# Altium schematic sheet 452006257#BDU控制板3-功能安全.SchDoc
size A3; SheetNumber: 11; SheetTotal: 14
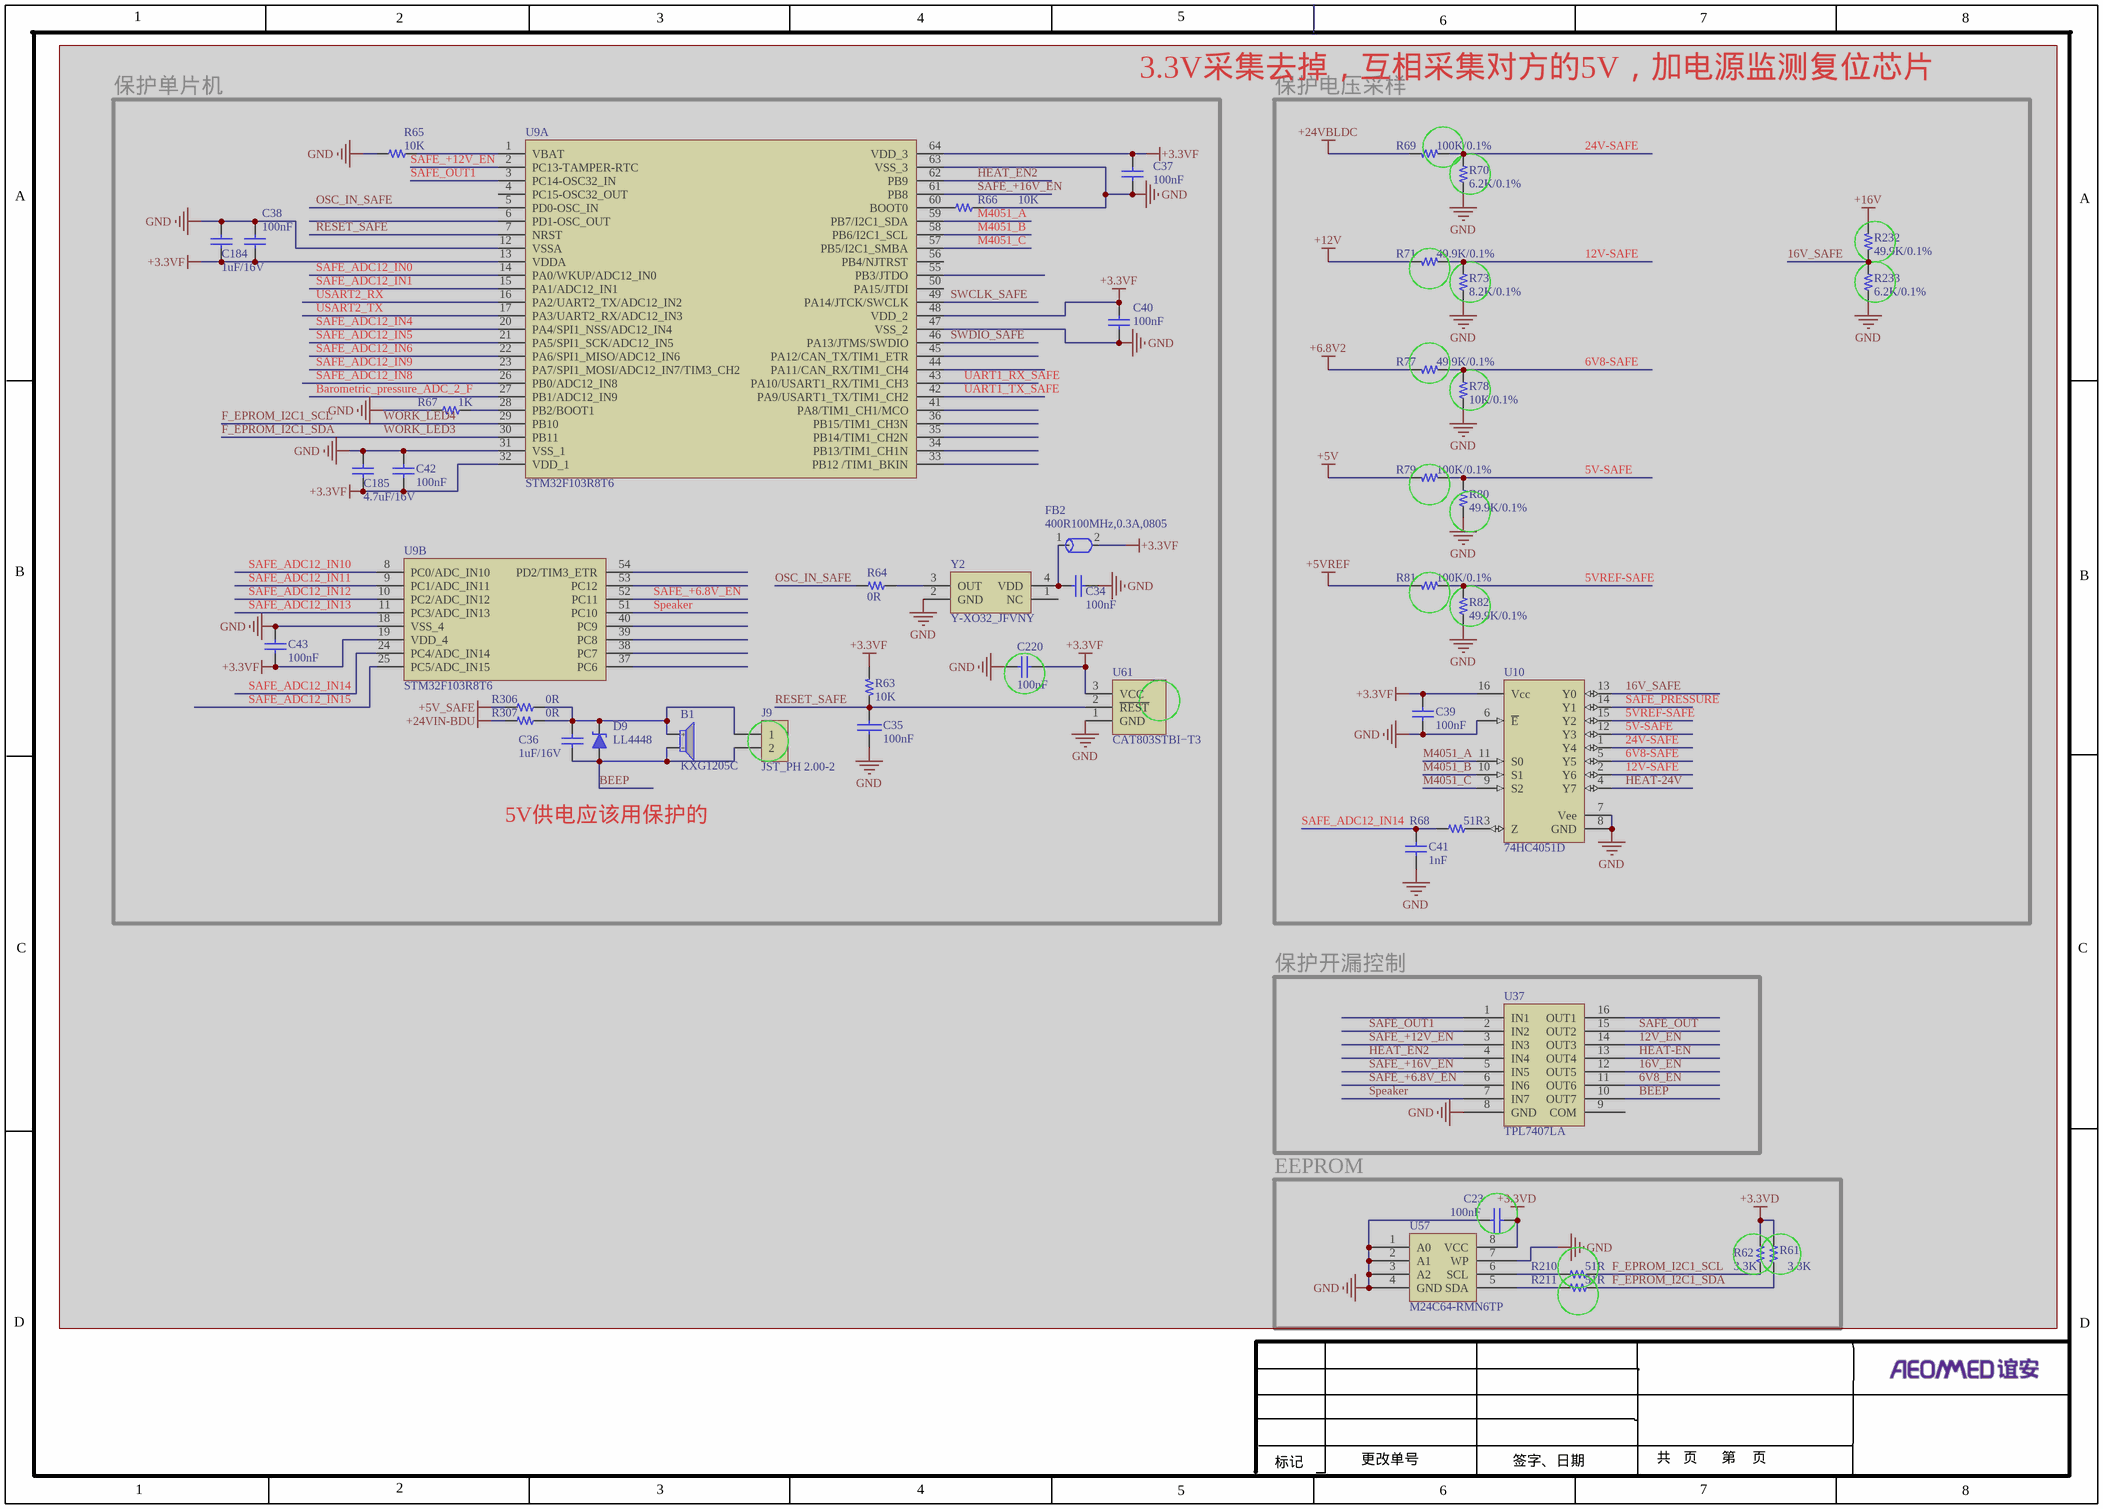
[diagram p0: 452006257#BDU控制板3-功能安全.SchDoc]

## Parts
B1  KXG1205C  [BEEP]  (masked out: inside a compile mask, not in the netlist)
C23  100nF  [C-0603]  (masked out: inside a compile mask, not in the netlist)
C34  100nF  [C-0603]  (masked out: inside a compile mask, not in the netlist)
C35  100nF  [C-0603]  (masked out: inside a compile mask, not in the netlist)
C36  1uF/16V  [C-0805]  (masked out: inside a compile mask, not in the netlist)
C37  100nF  [C-0603]  (masked out: inside a compile mask, not in the netlist)
C38  100nF  [C-0603]  (masked out: inside a compile mask, not in the netlist)
C39  100nF  [C-0603]  (masked out: inside a compile mask, not in the netlist)
C40  100nF  [C-0603]  (masked out: inside a compile mask, not in the netlist)
C41  1nF  [C-0603]  (masked out: inside a compile mask, not in the netlist)
C42  100nF  [C-0603]  (masked out: inside a compile mask, not in the netlist)
C43  100nF  [C-0603]  (masked out: inside a compile mask, not in the netlist)
C184  1uF/16V  [C-0805]  (masked out: inside a compile mask, not in the netlist)
C185  4.7uF/16V  [C-0805]  (masked out: inside a compile mask, not in the netlist)
C220  100nF  [C-0603]  (masked out: inside a compile mask, not in the netlist)
D9  LL4448  [DO-SOD-123]  (masked out: inside a compile mask, not in the netlist)
FB2  400R100MHz,0.3A,0805  [R-0805]  (masked out: inside a compile mask, not in the netlist)
J9  JST_PH 2.00-2  [JST_PH 2.00-2]  (masked out: inside a compile mask, not in the netlist)
R61  3.3K  [R-0603]  (masked out: inside a compile mask, not in the netlist)
R62  3.3K  [R-0603]  (masked out: inside a compile mask, not in the netlist)
R63  10K  [R-0603]  (masked out: inside a compile mask, not in the netlist)
R64  0R  [R-0603]  (masked out: inside a compile mask, not in the netlist)
R65  10K  [R-0603]  (masked out: inside a compile mask, not in the netlist)
R66  10K  [R-0603]  (masked out: inside a compile mask, not in the netlist)
R67  1K  [R-0603]  (masked out: inside a compile mask, not in the netlist)
R68  51R  [R-0603]  (masked out: inside a compile mask, not in the netlist)
R69  100K/0.1%  [R-0603]  (masked out: inside a compile mask, not in the netlist)
R70  6.2K/0.1%  [R-0603]  (masked out: inside a compile mask, not in the netlist)
R71  49.9K/0.1%  [R-0603]  (masked out: inside a compile mask, not in the netlist)
R73  8.2K/0.1%  [R-0603]  (masked out: inside a compile mask, not in the netlist)
R77  49.9K/0.1%  [R-0603]  (masked out: inside a compile mask, not in the netlist)
R78  10K/0.1%  [R-0603]  (masked out: inside a compile mask, not in the netlist)
R79  100K/0.1%  [R-0603]  (masked out: inside a compile mask, not in the netlist)
R80  49.9K/0.1%  [R-0603]  (masked out: inside a compile mask, not in the netlist)
R81  100K/0.1%  [R-0603]  (masked out: inside a compile mask, not in the netlist)
R82  49.9K/0.1%  [R-0603]  (masked out: inside a compile mask, not in the netlist)
R210  51R  [R-0603]  (masked out: inside a compile mask, not in the netlist)
R211  51R  [R-0603]  (masked out: inside a compile mask, not in the netlist)
R232  49.9K/0.1%  [R-0603]  (masked out: inside a compile mask, not in the netlist)
R233  6.2K/0.1%  [R-0603]  (masked out: inside a compile mask, not in the netlist)
R306  0R  [R-0603]  (masked out: inside a compile mask, not in the netlist)
R307  0R  [R-0603]  (masked out: inside a compile mask, not in the netlist)
U9  STM32F103R8T6  [LQFP-64]  (parts A,B of 2)  (masked out: inside a compile mask, not in the netlist)
U10  74HC4051D  [SOIC-16(9.95*3.90)]  (masked out: inside a compile mask, not in the netlist)
U37  TPL7407LA  [SOIC16]  (masked out: inside a compile mask, not in the netlist)
U57  M24C64-RMN6TP  [SOIC8]  (masked out: inside a compile mask, not in the netlist)
U61  CAT803STBI−T3  [SOT23-3]  (masked out: inside a compile mask, not in the netlist)
Y2  Y-XO32_JFVNY  [Y-XO32_JFVNY]  (masked out: inside a compile mask, not in the netlist)

## Blocks framed on the sheet
3.3V采集去掉，互相采集对方的5V，加电源监测复位芯片: B1 C34-C38 C40 C42 C43 C184 C185 C220 D9 FB2 J9 R63-R67 R306 R307 U9 U61 Y2
保护电压采样: C39 C41 R68-R71 R73 R77-R82 R232 R233 U10
保护开漏控制: U37
EEPROM: C23 R61 R62 R210 R211 U57

## Notes on the sheet
- 保护单片机
- 5V供电应该用保护的
- 1
- 2
- 3
- 4
- 5
- 6
- 7
- 8
- A
- B
- C
- D
- 更改单号
- 共   页      第    页
- 标记
- 签字、日期

## Library data of the parts
B1 = BEEP: 品牌：RS PRO,型号：KXG1205C，5V，94dBA; 厂家: *; 物料名称: *; 物料编号: *; 详细描述: *
C23 C35 = CAP: Capacitor
C34 C36 C39 C41 = C-0603: 物料编号: *; 物料名称: *; 厂家: *; 详细描述: *
C37 C38 C40 C42 C43 = 100nF_1: 贴片瓷介电容100nF±5%,0805; 物料编号: 210001894; 详细描述: X7R,50V,三星CL21B104JBCNNNC; 版本: V1.00; 制造商: 三星; 名称: 贴片瓷介电容100nF±5%,0805
C184 C185 = CAP: Capacitor; Fitted: True
C220 = C-0402: 物料编号: *; 物料名称: *; 厂家: *; 详细描述: *
D9 = Diode-稳压-213AB/LL34/MiniMELF: 厂家: *; 物料名称: *; 物料编号: *; 详细描述: *
FB2 = FB_1K/500mA_0805: Rdc0.3Ω,伍尔特,742792032; 名称: 贴片磁珠1K/500mA，0805; 版本: V1.00; 物料编号: 210001925; 详细描述: Rdc0.3,R材料,TDK MMZ2012R102A; 制造商: TDK
J9 = JST_PH 2.00-2: 品牌：JST 型号：B2B-PH-K-S，直插，间距2.00，2pin
R61 R62 R64 R68 R306 R307 = R-0603
R63 R69 R71 R77 R79 R81 R232 = 100Ω_1: 国巨RC0805FR-07100R; 物料编号: 210000765; 详细描述: 0805,1/8W,国巨RC0805FR-07100R; 制造商: 国巨; 版本: V1.00; 名称: 贴片电阻100±1%
R65 = R-0603: 10K±1%
R66 R67 R70 R73 R78 R80 R82 R233 = 3.3K_1: 国巨RC0805FR-073K3; 物料编号: 210001835; 详细描述: 0805,1/8W,国巨RC0805FR-073K3; 制造商: 国巨; 版本: V1.00; 名称: 贴片电阻3.3K±1%
R210 R211 = 51Ω_1: 国巨RC0805FR-0751R; 物料编号: 210002130; 详细描述: 0805,1/8W,国巨RC0805FR-0751R; 制造商: 国巨; 版本: V1.00; 名称: 贴片电阻51±1%
U9 = STM32F103C8T6-64P: 品牌：ST,型号：STM32F103C8T6,LQFP-64, -40 ~+105 °C，ROHS; 制造商: ST; 详细描述: ST,STM32F103C8T6,LQFP-64, -40 ~+105 °C; 名称: STM32F103C8T6
U10 = 74HC4051D: NXP,74HC4051D,SOIC-16,-40~+125°C ,; 版本: V1.00; 名称: 8路模拟开关74HC4051D; 物料编号: 210001936; 详细描述: NXP,74HC4051D,SOIC-16,-40~+125°C ,; 制造商: NXP
U57 = Component_1
U61 = CAT803TTBI-GT3: ON,CAT803TTBI-GT3,SOT23-3,-40o~+85oC,ROHS; 名称: 电源监视器CAT803TTBI-GT3; 制造商: ON; 详细描述: ON,CAT803TTBI-GT3,SOT23-3,-40o~+85oC,ROHS
Y2 = Y-XO32_JFVNY: 制造商: 晶宇兴